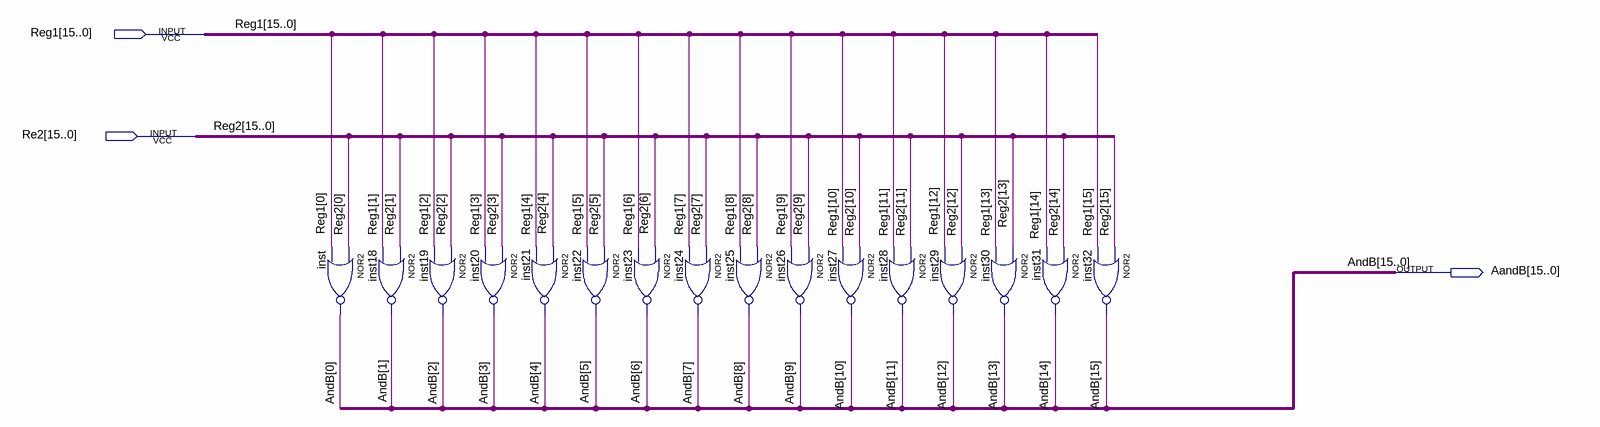
[diagram p0: schematic sheet]
// Quartus schematic 16_bit_NOR.bdf as structural Verilog: 16 symbols, 3 pins
module \16_bit_NOR  (
  input  [15:0] Reg1,
  input  [15:0] Re2,
  output [15:0] AandB
);

  nor inst (AandB[0], Re2[0], Reg1[0]);
  nor inst18 (AandB[1], Re2[1], Reg1[1]);
  nor inst19 (AandB[2], Re2[2], Reg1[2]);
  nor inst20 (AandB[3], Re2[3], Reg1[3]);
  nor inst21 (AandB[4], Re2[4], Reg1[4]);
  nor inst22 (AandB[5], Re2[5], Reg1[5]);
  nor inst23 (AandB[6], Re2[6], Reg1[6]);
  nor inst24 (AandB[7], Re2[7], Reg1[7]);
  nor inst25 (AandB[8], Re2[8], Reg1[8]);
  nor inst26 (AandB[9], Re2[9], Reg1[9]);
  nor inst27 (AandB[10], Re2[10], Reg1[10]);
  nor inst28 (AandB[11], Re2[11], Reg1[11]);
  nor inst29 (AandB[12], Re2[12], Reg1[12]);
  nor inst30 (AandB[13], Re2[13], Reg1[13]);
  nor inst31 (AandB[14], Re2[14], Reg1[14]);
  nor inst32 (AandB[15], Re2[15], Reg1[15]);

  // Other names for the same wires on the sheet: AndB[15:0] = AandB; Reg2[15:0] = Re2
endmodule
